# EAGLE design Doser v0.1 (EAGLE 5.11)
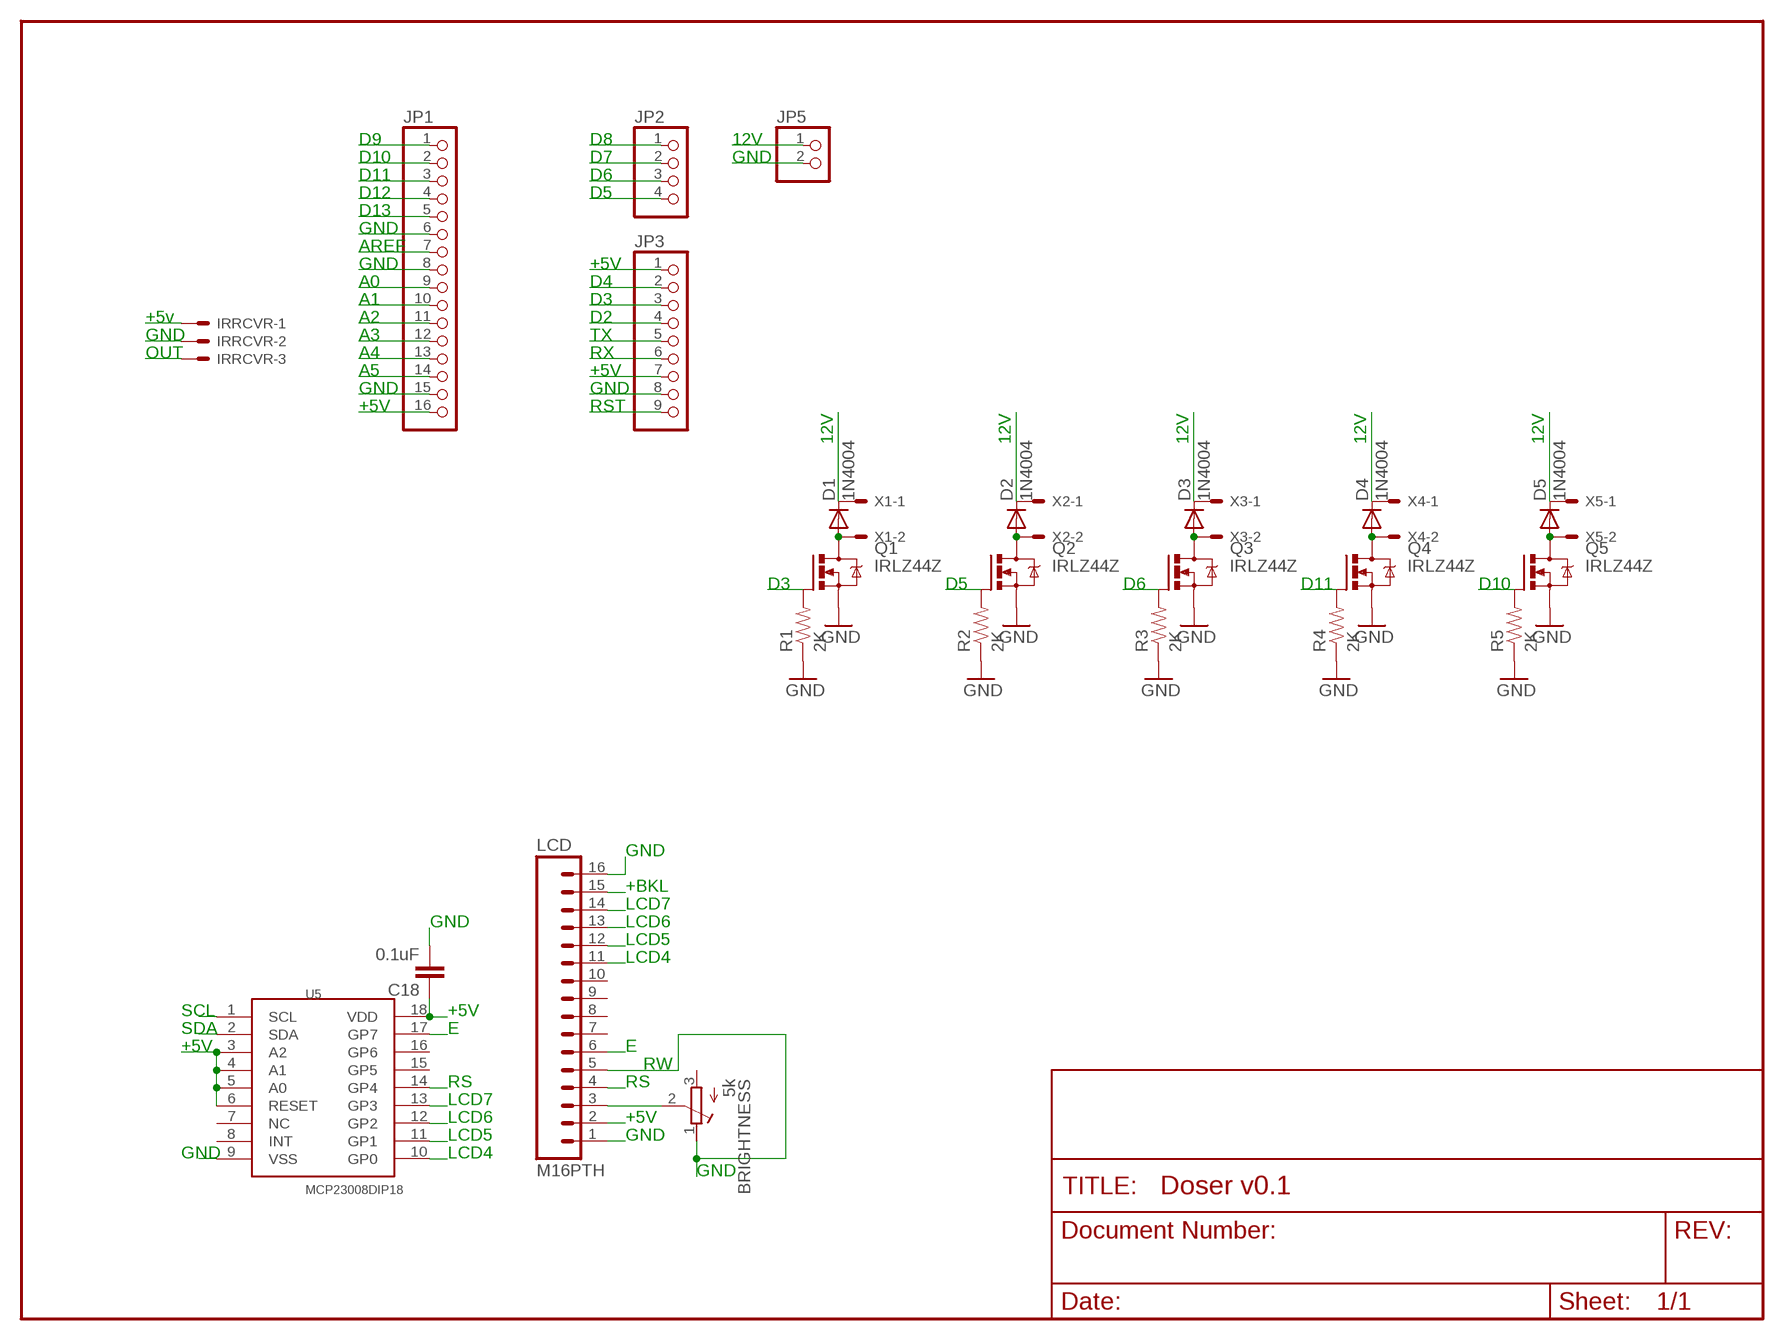
[diagram p0: schematic, sheet 1]

## Parts
BRIGHTNESS  5k  R-TRIMMT93YA  [RTRIMT93YA]
C18  0.1uF  CAPPTH  [CAP-PTH-SMALL]
D1  1N4004  [DO41-10]
D2  1N4004  [DO41-10]
D3  1N4004  [DO41-10]
D4  1N4004  [DO41-10]
D5  1N4004  [DO41-10]
IRRCVR  KK-156-3  [KK-156-3]
JP1  PINHD-1X16  [1X16]
JP2  PINHD-1X4  [1X04]
JP3  PINHD-1X9  [1X09]
JP5  PINHD-1X2  [1X02]
LCD  M16PTH  [1X16]
Q1  IRLZ44Z  [TO220BH]
Q2  IRLZ44Z  [TO220BH]
Q3  IRLZ44Z  [TO220BH]
Q4  IRLZ44Z  [TO220BH]
Q5  IRLZ44Z  [TO220BH]
R1  2K  RESISTORPTH-1/4W  [AXIAL-0.4]
R2  2K  RESISTORPTH-1/4W  [AXIAL-0.4]
R3  2K  RESISTORPTH-1/4W  [AXIAL-0.4]
R4  2K  RESISTORPTH-1/4W  [AXIAL-0.4]
R5  2K  RESISTORPTH-1/4W  [AXIAL-0.4]
U5  MCP23008DIP18  [DIL18]
X1  KK-156-2  [KK-156-2]
X2  KK-156-2  [KK-156-2]
X3  KK-156-2  [KK-156-2]
X4  KK-156-2  [KK-156-2]
X5  KK-156-2  [KK-156-2]

## Nets
+5V [power]: C18.1 IRRCVR.1 JP1.16 LCD.2 U5.3(A2) U5.4(A1) U5.5(A0) U5.6(RESET) U5.18(VDD)
A0: JP1.9
A1: JP1.10
A2: JP1.11
A3: JP1.12
ADFS [power]: JP3.1
AREF: JP1.7
ASDFFDSA [power]: JP3.7
D8: IRRCVR.3 JP2.1
D9: JP1.1 LCD.15
D10: JP1.2 Q5.G R5.P$2
D11: JP1.3 Q4.G R4.P$2
D12: JP1.4
D13: JP1.5
E1: LCD.6 U5.17(GP7)
GND [power]: BRIGHTNESS.1(A) C18.2 IRRCVR.2 JP1.6 JP1.8 JP1.15 JP3.8 JP5.2 LCD.1 LCD.5 LCD.16 Q1.S Q2.S Q3.S Q4.S Q5.S R1.P$1 R2.P$1 R3.P$1 R4.P$1 R5.P$1 U5.9(VSS)
LCD4: LCD.11 U5.10(GP0)
LCD5: LCD.12 U5.11(GP1)
LCD6: LCD.13 U5.12(GP2)
LCD7: LCD.14 U5.13(GP3)
N$1: D2.A Q2.D X2.2
N$2: D1.A Q1.D X1.2
N$5: D3.A Q3.D X3.2
N$7: D4.A Q4.D X4.2
N$9: D5.A Q5.D X5.2
N$10: BRIGHTNESS.2(S) LCD.3
RD2: JP3.4
RD3: JP3.3 Q1.G R1.P$2
RD4: JP3.2
RD5: JP2.4 Q2.G R2.P$2
RD6: JP2.3 Q3.G R3.P$2
RD7: JP2.2
RS1: LCD.4 U5.14(GP4)
RST: JP3.9
RX: JP3.6
SCL: JP1.14 U5.1(SCL)
SDA: JP1.13 U5.2(SDA)
TX: JP3.5
VIN: D1.C JP5.1 X1.1
VIN1: D2.C X2.1
VIN2: D3.C X3.1
VIN3: D4.C X4.1
VIN4: D5.C X5.1
Unconnected: BRIGHTNESS.3(E) LCD.7 LCD.8 LCD.9 LCD.10 U5.7(NC) U5.8(INT) U5.15(GP5) U5.16(GP6)

## Notes on the sheet
- D9 | D8 | 12V
- D10 | D7 | GND
- D11 | D6
- D12 | D5
- D13
- GND
- AREF
- GND | +5V
- A0 | D4
- A1 | D3
- +5v | A2 | D2
- GND | A3 | TX
- OUT | A4 | RX
- A5 | +5V
- GND | GND
- +5V | RST
- 12V | 12V | 12V | 12V | 12V
- D3 | D5 | D6 | D11 | D10
- GND
- +BKL
- LCD7
- GND | LCD6
- LCD5
- LCD4
- SCL | +5V
- SDA | E
- +5V | E
- RW
- RS | RS
- LCD7
- LCD6 | +5V
- LCD5 | GND
- GND | LCD4
- GND

## Library data of the parts
BRIGHTNESS = resistor:R-TRIMM: Trimm resistor
C18 = _allyourbase:CAP: Capacitor Standard 0603 ceramic capacitor, and 0.1" leaded capacitor.
D1-D5 = diode:1N4004: DIODE general purpose rectifier, 1 A
IRRCVR = con-molex:KK-156-3: KK 156 HEADER Source: http://www.molex.com/pdm_docs/sd/026604100_sd.pdf; OC_FARNELL: unknown; OC_NEWARK: unknown
JP1 = pinhead:PINHD-1X16: PIN HEADER
JP2 = pinhead:PINHD-1X4: PIN HEADER
JP3 = pinhead:PINHD-1X9: PIN HEADER
JP5 = pinhead:PINHD-1X2: PIN HEADER
LCD = SparkFun:M16
Q1-Q5 = transistor-power:IRLZ44Z: N-Channel HEXFET® Power MOSFET Logic Level AUTOMOTIVE MOSFET Source: http://www.irf.com/product-info/datasheets/data/irlz44zpbf.pdf
R1-R5 = SparkFun:RESISTOR: Resistor Basic schematic elements and footprints for 0603, 1206, and PTH resistors.
U5 = _allyourbase:MCP23008
X1-X5 = con-molex:KK-156-2: KK 156 HEADER Source: http://www.molex.com/pdm_docs/sd/026604100_sd.pdf; OC_FARNELL: unknown; OC_NEWARK: unknown

## Net classes
0 default: width 0.203 mm, drill 0.508 mm, clearance 0.203 mm
1 power: width 0.254 mm, drill 0.508 mm, clearance 0.203 mm

## Board
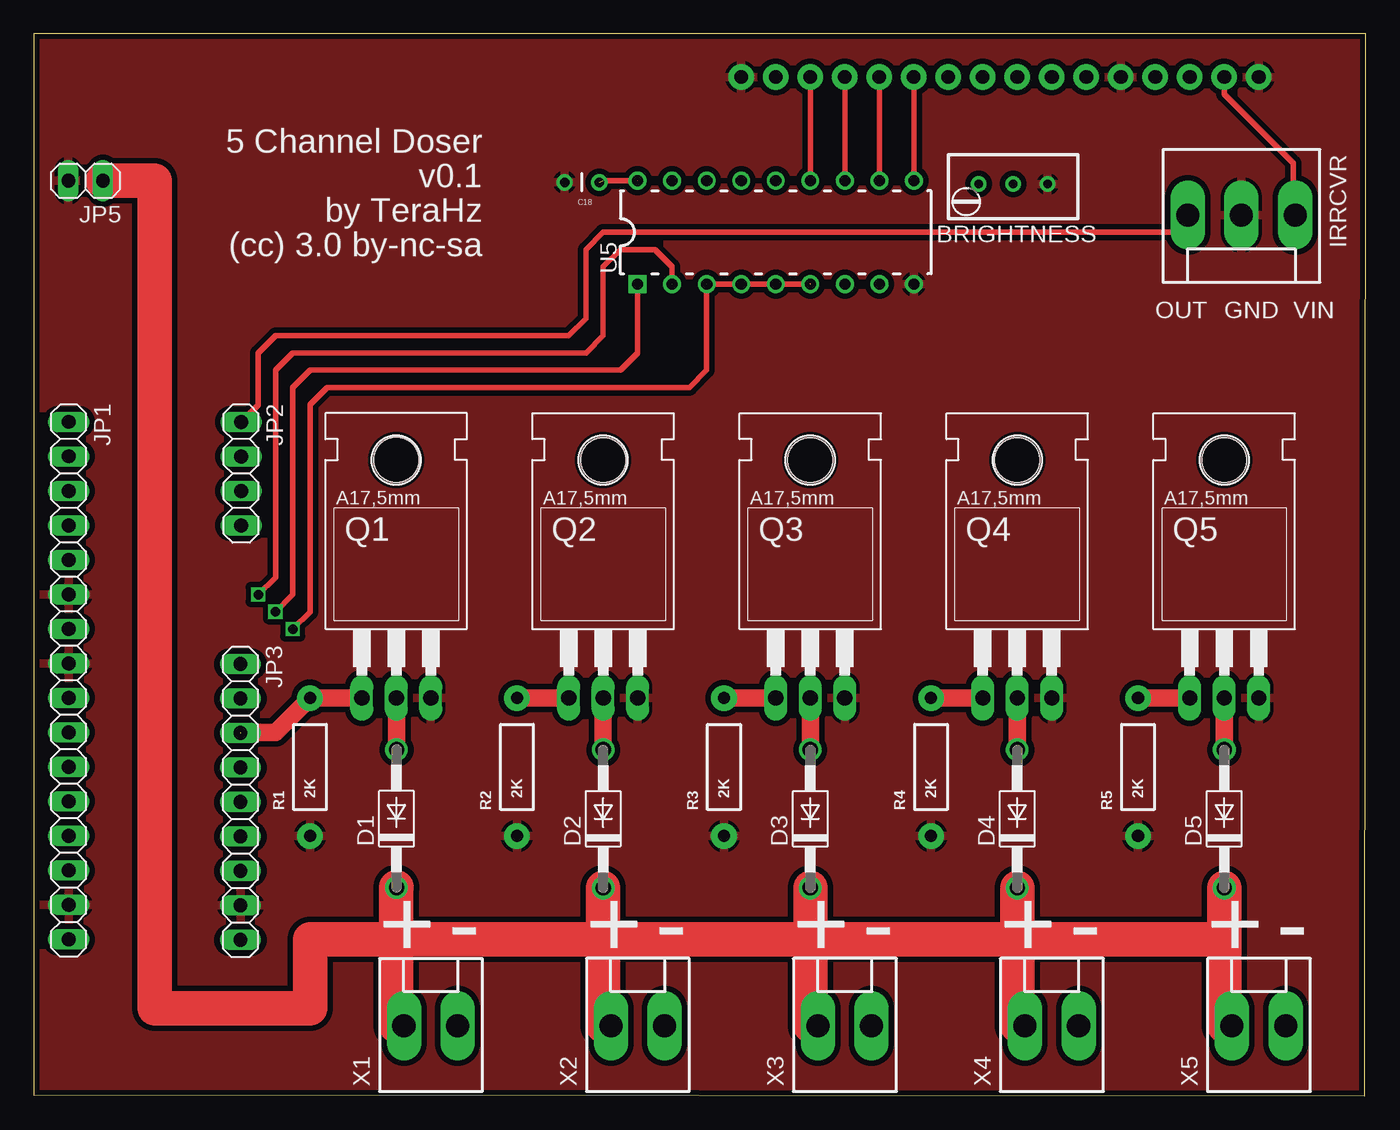
[diagram p1: board, top side]
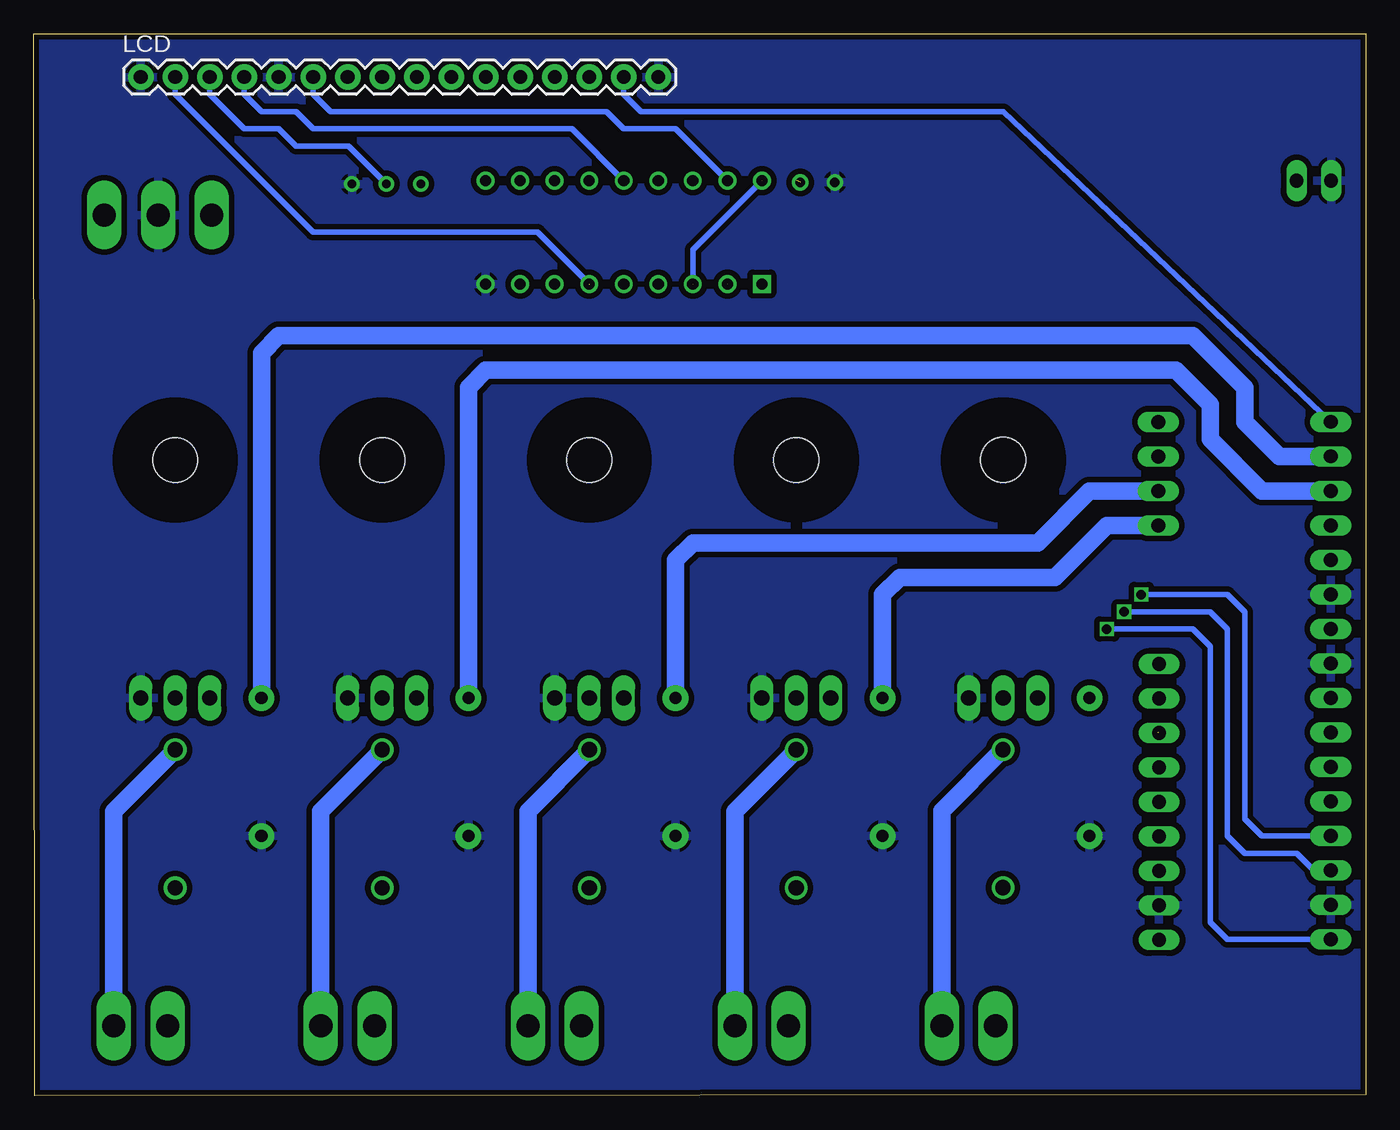
[diagram p2: board, bottom side, seen from below]

Size 98.03 x 78.18 mm. Coordinates in mm from the lower left corner, seen from the top.
Outline: 0,0.08 97.98,0 98.03,78.18 0,78.18 0,0.08
Copper layers (1*16): Top 0.035mm / dielectric 1.5mm / Bottom 0.035mm
Design rules "Fusion_eagle_rule_v1.1": minimum track width 6mil, minimum drill 12mil, track to track 6mil, track to pad 6mil, pad to pad 6mil, via to via 6mil, smd to smd 0mil, copper to edge 10mil, drill to drill 10mil, minimum pad ring 10mil, minimum via ring 6mil, stop-mask expansion 2mil, vias tented up to drill 100mil, thermal gap 10mil

### Footprints (pad centres in the part's own frame; a part is rotated, then mirrored left to right if it is on the bottom)
RTRIMT93YA = drill 0.61 round: 1 0,-2.54; 2 0,0; 3 0,2.54
CAP-PTH-SMALL = drill 0.7 round: 1 0,0; 2 2.54,0
DO41-10 = drill 1.118 round: A 5.08,0; C -5.08,0
KK-156-3 = drill 1.7 pad 2.184 long: 1 -3.96,0; 2 0,0; 3 3.96,0
1X16 = drill 1.016 long: 1 -19.05,0; 2 -16.51,0; 3 -13.97,0; 4 -11.43,0; 5 -8.89,0; 6 -6.35,0; 7 -3.81,0; 8 -1.27,0; 9 1.27,0; 10 3.81,0; 11 6.35,0; 12 8.89,0; 13 11.43,0; 14 13.97,0; 15 16.51,0; 16 19.05,0
1X04 = drill 1.016 long: 1 -3.81,0; 2 -1.27,0; 3 1.27,0; 4 3.81,0
1X09 = drill 1.016 long: 1 -10.16,0; 2 -7.62,0; 3 -5.08,0; 4 -2.54,0; 5 0,0; 6 2.54,0; 7 5.08,0; 8 7.62,0; 9 10.16,0
1X02 = drill 1.016 long: 1 -1.27,0; 2 1.27,0
1X16' = drill 1.016 pad 1.88 round: 1 0,0; 2 2.54,0; 3 5.08,0; 4 7.62,0; 5 10.16,0; 6 12.7,0; 7 15.24,0; 8 17.78,0; 9 20.32,0; 10 22.86,0; 11 25.4,0; 12 27.94,0; 13 30.48,0; 14 33.02,0; 15 35.56,0; 16 38.1,0
TO220BH = drill 1.118 long: D 0,-6.35; G -2.54,-6.35; S 2.54,-6.35 | hole 3.302: 0,11.176
AXIAL-0.4 = drill 0.9 pad 1.88 round: P$1 -5.08,0; P$2 5.08,0
DIL18 = drill 0.813 square: 1 -10.16,-3.81 | drill 0.813 round: 2 -7.62,-3.81; 3 -5.08,-3.81; 4 -2.54,-3.81; 5 0,-3.81; 6 2.54,-3.81; 7 5.08,-3.81; 8 7.62,-3.81; 9 10.16,-3.81; 10 10.16,3.81; 11 7.62,3.81; 12 5.08,3.81; 13 2.54,3.81; 14 0,3.81; 15 -2.54,3.81; 16 -5.08,3.81; 17 -7.62,3.81; 18 -10.16,3.81
KK-156-2 = drill 1.7 pad 2.184 long: 1 -1.98,0; 2 1.98,0

### Placement (x,y rotation side)
BRIGHTNESS  72.09,67.13 90 top
C18  41.61,67.26 180 top
D1  26.69,20.41 90 top
D2  41.91,20.4 90 top
D3  57.15,20.4 90 top
D4  72.39,20.4 90 top
D5  87.63,20.4 90 top
IRRCVR  88.9,64.85 180 top
JP1  2.56,30.57 270 top
JP2  15.25,45.8 270 top
JP3  15.21,21.63 270 top
JP5  3.8,67.37 180 top
LCD  M16PTH  [1X16']  90.17,75.01 0 bottom
Q1  26.68,35.65 0 top
Q2  41.91,35.64 0 top
Q3  57.15,35.64 0 top
Q4  72.39,35.64 0 top
Q5  87.63,35.64 0 top
R1  20.33,24.21 90 top
R2  35.56,24.21 90 top
R3  50.8,24.21 90 top
R4  66.04,24.21 90 top
R5  81.28,24.21 90 top
U5  54.61,63.58 0 top
X1  29.22,5.15 0 top
X2  44.45,5.16 0 top
X3  59.69,5.16 0 top
X4  74.93,5.16 0 top
X5  90.17,5.16 0 top

### Tracks (layer width: path | path; a pad name or v marks a point on that pad's centre or on a via)
+5V  (via drill 0.7)  (5 unrouted)
  Top 0.406: 87.63,73.73 LCD.2 | U5.3 U5.6 U5.5 U5.4 | 41.91,67.39 U5.18 | v19.05,34.37 20.32,35.64 20.32,50.88 21.59,52.15 48.26,52.15 49.53,53.42 U5.3 | IRRCVR.1 92.71,65 92.71,68.66 87.63,73.74 LCD.2
  Bottom 0.406: JP1.16 3.84,11.51 10.16,11.51 11.43,12.78 11.43,33.1 12.7,34.37 v19.05,34.37 | U5.6 60.95,63.58 77.47,63.58 87.63,73.74 LCD.2 | U5.18 49.52,62.31 49.53,62.31 U5.3
D8
  Top 0.406: JP2.1 16.51,50.87 16.51,54.69 17.78,55.96 39.37,55.96 40.64,57.23 40.64,62.31 41.91,63.58 83.82,63.58 84.94,64.7 IRRCVR.3
D9
  Bottom 0.406: JP1.1 26.68,72.47 53.34,72.47 54.61,73.74 LCD.15
D10
  Top 1.27: R5.P$2 Q5.G
  Bottom 1.27: R5.P$2 81.28,54.69 80.01,55.96 12.7,55.96 8.89,52.15 8.89,49.61 6.35,47.07 3.84,47.07 JP1.2
D11
  Top 1.27: R4.P$2 Q4.G
  Bottom 1.27: JP1.3 3.84,44.53 7.62,44.53 11.43,48.34 11.43,50.88 13.97,53.42 64.77,53.42 66.04,52.15 R4.P$2
E1
  Bottom 0.406: LCD.6 77.47,73.74 76.2,72.47 55.88,72.47 54.61,71.2 50.8,71.2 U5.17
GND
  pour Bottom (isolate 0.406): -1.27,78.86 98.46,78.86 98.46,-0.92 0,-0.92
  pour Top (isolate 0.406): -1.27,78.82 97.79,78.82 97.79,0.08 0,0.08
LCD4
  Top 0.406: U5.10 LCD.11
LCD5
  Top 0.406: U5.11 LCD.12
LCD6
  Top 0.406: U5.12 LCD.13
LCD7
  Top 0.406: U5.13 LCD.14
N$1
  Top 1.27: D2.A Q2.D
  Bottom 1.27: D2.A 46.43,20.96 X2.2
N$2
  Top 1.27: Q1.D D1.A
  Bottom 1.27: D1.A 31.2,20.98 X1.2
N$5
  Top 1.27: D3.A Q3.D
  Bottom 1.27: D3.A 61.67,20.96 X3.2
N$7
  Top 1.27: D4.A Q4.D
  Bottom 1.27: D4.A 76.91,20.96 X4.2
N$9
  Top 1.27: D5.A Q5.D
  Bottom 1.27: D5.A 92.15,20.96 X5.2
N$10
  Bottom 0.406: BRIGHTNESS.2 74.88,69.93 78.74,69.93 80.01,71.2 82.55,71.2 85.09,73.74 LCD.3
RD3  (1 unrouted)
  Top 1.27: Q1.G R1.P$2 17.78,26.75 15.24,26.75
RD5
  Top 1.27: R2.P$2 Q2.G
  Bottom 1.27: JP2.4 19.05,41.99 22.86,38.18 34.29,38.18 35.56,36.91 R2.P$2
RD6
  Top 1.27: R3.P$2 Q3.G
  Bottom 1.27: JP2.3 20.32,44.53 24.13,40.72 49.53,40.72 50.8,39.45 R3.P$2
RS1
  Bottom 0.406: U5.14 58.42,71.2 77.47,71.2 78.74,72.47 81.28,72.47 82.55,73.74 LCD.4
SCL  (via drill 0.7)
  Top 0.406: v17.78,35.64 19.05,36.91 19.05,52.15 20.32,53.42 43.18,53.42 44.45,54.69 U5.1
  Bottom 0.406: v17.78,35.64 11.43,35.64 10.16,34.37 10.16,19.13 8.89,17.86 5.08,17.86 3.81,16.59 3.81,16.6 JP1.14
SDA  (via drill 0.7)  (1 unrouted)
  Top 0.406: v16.51,36.91 17.78,38.18 17.78,53.42 19.05,54.69 40.64,54.69 41.91,55.96 41.91,61.04 43.18,62.31 45.72,62.31 46.99,61.04 U5.2
  Bottom 0.406: JP1.13 3.84,19.13 7.62,19.13 8.89,20.4 8.89,35.64 10.16,36.91 v16.51,36.91
  Bottom 0.813: U5.2
VIN
  Top 2.54: JP5.1 8.89,67.37 8.89,6.43 20.32,6.43 20.32,11.51 26.67,11.51 | 26.67,11.51 87.63,11.51 | D1.C 26.67,15.33 26.67,11.51 | X1.1 26.67,5.15 26.67,11.51
VIN1
  Top 2.54: X2.1 41.91,5.16 D2.C
VIN2
  Top 2.54: X3.1 57.15,5.16 D3.C
VIN3
  Top 2.54: X4.1 72.39,5.16 D4.C
VIN4
  Top 2.54: X5.1 87.63,5.16 D5.C

### Text on the board
tNames: 5 Channel Doser | v0.1 | by TeraHz | (cc) 3.0 by-nc-sa | OUT | GND | VIN | + | - | + | - | + | - | + | - | + | -